# EAGLE design ASM2101 (EAGLE 6.3)
DATABASE: ./../../../../../Components/TinyCircuits_Part_Database.txt
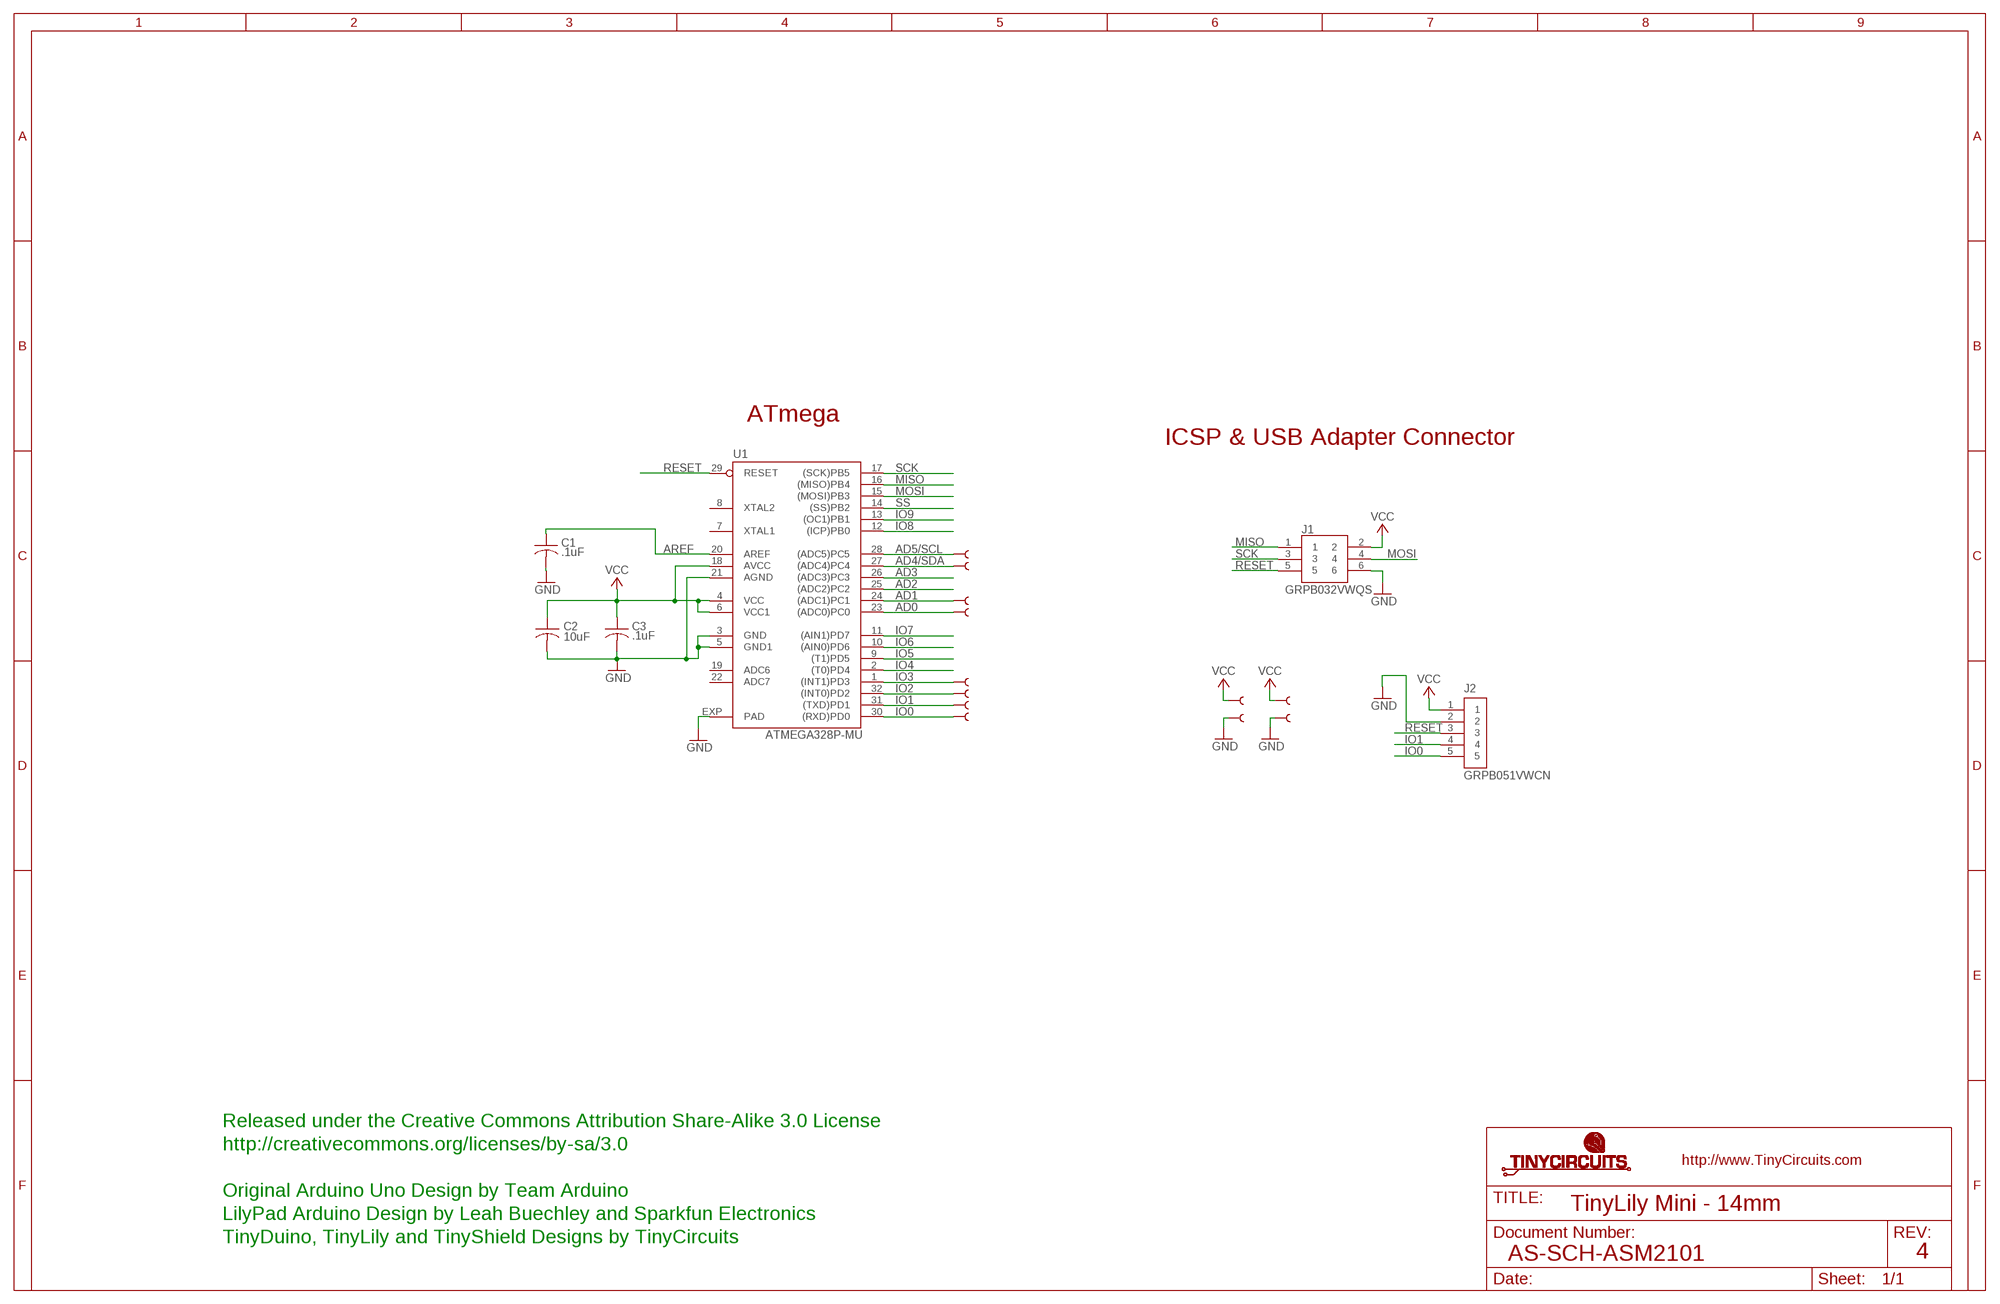
[diagram p0: schematic, sheet 1]

## Parts
$1  SEWTAB  [SEWTAP_TH]
C1  .1uF  AS-ITM-00008  [C0402]
C2  10uF  AS-ITM-00002  [C0603]
C3  .1uF  AS-ITM-00008  [C0402]
J1  GRPB032VWQS  AS-ITM-00034  [2X3_.05"_SMT_HEADER]
J2  GRPB051VWCN  AS-ITM-00036  [1X5_.05_RA_TH_HEADER]
U1  ATMEGA328P-MU  AS-ITM-00013MU  [ATMEL_QFN32]
U$1  SEWTAB  [SEWTAP_TH]
U$2  SEWTAB  [SEWTAP_TH]
U$3  SEWTAB  [SEWTAP_TH]
U$4  SEWTAB  [SEWTAP_TH]
U$5  SEWTAB  [SEWTAP_TH]
U$7  SEWTAB  [SEWTAP_TH]
U$8  SEWTAB  [SEWTAP_TH]
U$9  SEWTAB  [SEWTAP_TH]
U$10  SEWTAB  [SEWTAP_TH]
U$11  SEWTAB  [SEWTAP_TH]
U$12  SEWTAB  [SEWTAP_TH]

## Nets
AD0: U1.23((ADC0)PC0) U$4.1
AD1: U1.24((ADC1)PC1) U$3.1
AD2: U1.25((ADC2)PC2)
AD3: U1.26((ADC3)PC3)
AD4/SDA: U1.27((ADC4)PC4) U$2.1
AD5/SCL: U1.28((ADC5)PC5) U$1.1
AREF: C1.1 U1.20(AREF)
GND: C1.2 C2.2 C3.2 J1.6 J2.2 U1.3(GND) U1.5(GND1) U1.21(AGND) U1.EXP(PAD) U$11.1 U$12.1
IO0: J2.5 U1.30((RXD)PD0) U$10.1
IO1: J2.4 U1.31((TXD)PD1) U$9.1
IO2: $1.1 U1.32((INT0)PD2)
IO3: U1.1((INT1)PD3) U$5.1
IO4: U1.2((T0)PD4)
IO5: U1.9((T1)PD5)
IO6: U1.10((AIN0)PD6)
IO7: U1.11((AIN1)PD7)
IO8: U1.12((ICP)PB0)
IO9: U1.13((OC1)PB1)
MISO: J1.1 U1.16((MISO)PB4)
MOSI: J1.4 U1.15((MOSI)PB3)
RESET: J1.5 J2.3 U1.29(RESET)
SCK: J1.3 U1.17((SCK)PB5)
SS: U1.14((SS)PB2)
VCC: C2.1 C3.1 J1.2 J2.1 U1.4(VCC) U1.6(VCC1) U1.18(AVCC) U$7.1 U$8.1
Unconnected: U1.7(XTAL1) U1.8(XTAL2) U1.19(ADC6) U1.22(ADC7)

## Notes on the sheet
- ATmega
- ICSP & USB Adapter Connector
- Released under the Creative Commons Attribution Share-Alike 3.0 License
- http://creativecommons.org/licenses/by-sa/3.0
- Original Arduino Uno Design by Team Arduino
- TinyLily Mini - 14mm
- LilyPad Arduino Design by Leah Buechley and Sparkfun Electronics
- TinyDuino, TinyLily and TinyShield Designs by TinyCircuits
- AS-SCH-ASM2101 | 4

## Library data of the parts
$1 U$1-U$5 U$7-U$12 = tinycircuits:SEWTAB: TinyLily Sew Tab; BOM: EXCLUDE; DNP: T
C1 C3 = tinycircuits:AS-ITM-00008: CAP CER 0.1UF 16V 10% X5R 0402; PARTNO: AS-ITM-00008; VALUE: 0.1uF
C2 = tinycircuits:AS-ITM-00002: CAP CER 10UF 10V 20% X5R 0603; PARTNO: AS-ITM-00002
J1 = tinycircuits:AS-ITM-00034: CONN HEADER .050" SMD 6POS; DNP: T; PARTNO: AS-ITM-00034
J2 = tinycircuits:AS-ITM-00036: CONN HEADER .050" 5POS TH RA; PARTNO: AS-ITM-00036
U1 = tinycircuits:AS-ITM-00013: MCU AVR 32K FLASH 32-QFN; PARTNO: AS-ITM-00013

## Board
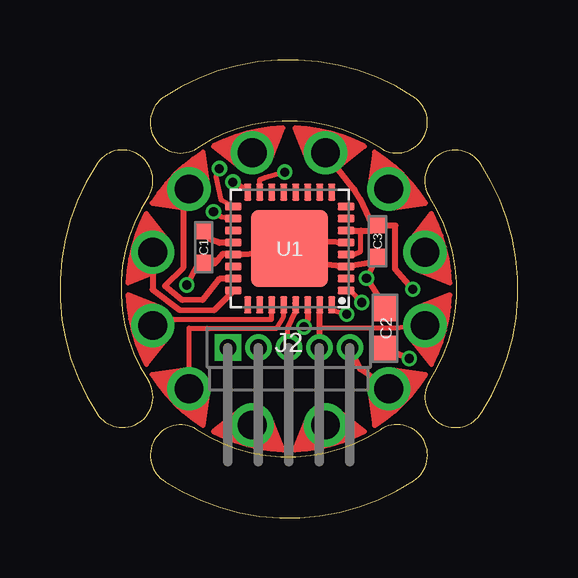
[diagram p1: board, top side]
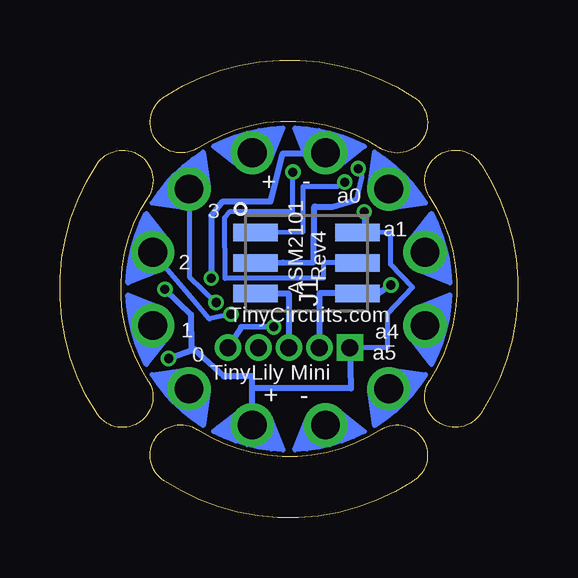
[diagram p2: board, bottom side, seen from below]

Size 19.07 x 19.07 mm. Coordinates in mm from the lower left corner, seen from the top.
Outline: 5.68,3.7 arc180 4.39,1.51 arc66 14.75,1.55 arc180 13.35,3.67 arc-66 5.68,3.7
Outline: 15.38,5.68 arc180 17.57,4.39 arc66 17.53,14.75 arc180 15.41,13.35 arc-66 15.38,5.68
Outline: 3.7,13.41 arc180 1.51,14.7 arc66 1.55,4.34 arc180 3.67,5.74 arc-66 3.7,13.41
Outline: 13.4,15.38 arc180 14.69,17.57 arc66 4.33,17.53 arc180 5.73,15.41 arc-66 13.4,15.38
Copper layers (1*16): Top 0.035mm / dielectric 1.5mm / Bottom 0.035mm
Design rules "default": minimum track width 8mil, minimum drill 15mil, track to track 6mil, track to pad 6mil, pad to pad 6mil, via to via 6mil, smd to smd 6mil, copper to edge 6mil, drill to drill 8mil, minimum pad ring 8mil, minimum via ring 5mil, stop-mask expansion 4mil, vias tented up to drill 25mil, thermal gap 10mil

### Footprints (pad centres in the part's own frame; a part is rotated, then mirrored left to right if it is on the bottom)
SEWTAP_TH = drill 1.2 pad 1.803: 1 -0.127,0
C0402 = smd 0.65 x 0.6: 1 -0.65,0; 2 0.65,0
C0603 = smd 1.1 x 1: 1 -0.85,0; 2 0.85,0
2X3_.05"_SMT_HEADER = smd 1.854 x 0.737: 1 -2.125,1.27; 2 2.125,1.27; 3 -2.125,0; 4 2.125,0; 5 -2.125,-1.27; 6 2.125,-1.27
1X5_.05_RA_TH_HEADER = drill 0.7 pad 1.016 square: 1 -0.635,2.54 | drill 0.7 pad 1.016: 2 -0.635,1.27; 3 -0.635,0; 4 -0.635,-1.27; 5 -0.635,-2.54
ATMEL_QFN32 = smd 0.711 x 0.305: 1 -2.351,1.75; 2 -2.351,1.25; 3 -2.351,0.75; 4 -2.351,0.25; 5 -2.351,-0.25; 6 -2.351,-0.75; 7 -2.351,-1.25; 8 -2.351,-1.75; 17 2.351,-1.75; 18 2.351,-1.25; 19 2.351,-0.75; 20 2.351,-0.25; 21 2.351,0.25; 22 2.351,0.75; 23 2.351,1.25; 24 2.351,1.75 | smd 0.305 x 0.711: 9 -1.75,-2.351; 10 -1.25,-2.351; 11 -0.75,-2.351; 12 -0.25,-2.351; 13 0.25,-2.351; 14 0.75,-2.351; 15 1.25,-2.351; 16 1.75,-2.351; 25 1.75,2.351; 26 1.25,2.351; 27 0.75,2.351; 28 0.25,2.351; 29 -0.25,2.351; 30 -0.75,2.351; 31 -1.25,2.351; 32 -1.75,2.351 | smd 3.2 x 3.2: EXP 0,0

### Placement (x,y rotation side)
$1  15.09,11.03 345 bottom
C1  5.99,11.27 270 top
C2  13.55,7.89 90 top
C3  13.23,11.53 270 top
J1  8.81,10.62 0 bottom
J2  9.54,7.72 90 top
U1  9.57,11.22 180 top
U$1  5.47,5.47 135 bottom
U$2  3.99,8.05 165 bottom
U$3  3.99,11.03 195 bottom
U$4  5.47,13.61 225 bottom
U$5  13.61,13.61 315 bottom
U$6  [DOCFIELD-TINYCIRCUITS-PCB]  32.54,-9.46 0 top  (outside the outline)
U$7  11.03,3.99 75 bottom
U$8  11.03,15.09 285 bottom
U$9  15.09,8.05 15 bottom
U$10  13.61,5.47 45 bottom
U$11  8.05,3.99 105 bottom
U$12  8.05,15.09 255 bottom

### Tracks (layer width: path | path; a pad name or v marks a point on that pad's centre or on a via)
AD0
  Top 0.203: 6.92,9.95 6.94,9.95
  Top 0.254: U$4.1 5.13,12.87 5.13,10.41 4.37,9.66 5.1,9.07 5.94,9.08 6.64,9.95 6.94,9.95 7.12,9.96 7.1,9.95 | 6.92,9.95 U1.23
AD1
  Top 0.254: U$3.1 3.86,9.51 4.97,8.66 6.44,8.65 7.23,9.47 U1.24
AD4/SDA
  Top 0.203: 8.81,8.84 8.81,8.26 4.11,8.26
  Top 0.254: U1.27 8.81,8.84 | 4.11,8.26 U$2.1
AD5/SCL
  Top 0.203: U$1.1 5.38,7.9 9.03,7.9 9.31,8.38 U1.28
AREF
  Top 0.254: U1.20 6.65,11.46 6.29,11.59 C1.1
GND  (via drill 0.38)
  Top 0.203: U1.EXP 8.89,11.07
  Top 0.254: U1.5 9.88,11.55 | 9.88,11.55 U1.EXP 10.69,10.58 U1.3 13.2,10.67 C3.2 v12.77,9.98 C2.2 | 8.89,11.07 U1.21 6.78,10.99 6.58,10.74 6.57,10.73 | 9.88,11.55 9.7,11.56 | C1.2 6.05,10.73 6.57,10.73 | 6.57,10.73 6.43,10.59 5.76,10.59 5.74,10.57 v5.28,9.7 | U$11.1 8.23,4.88 J2.2
  Bottom 0.254: v5.28,9.7 5.8,9.34 J1.6 8.27,9.35 J2.2 | U$12.1 8.06,15.17 9.8,15.17 10.31,13.18 12.29,13.18 12.77,12.57 v12.77,9.98
IO0  (via drill 0.38)
  Top 0.254: U1.30 10.32,8.27 v10.17,7.95 | U$10.1 12.49,6.2 J2.5
  Bottom 0.254: v10.17,7.95 11.53,7.94 J2.5
IO1
  Top 0.203: U$9.1 13.97,7.9 11.27,7.9 10.83,7.9
  Top 0.254: J2.4 10.83,7.9 U1.31
IO2  (via drill 0.38)
  Top 0.203: 11.3,8.66 v11.95,8.47
  Top 0.254: U1.32 11.3,8.66
  Bottom 0.203: v11.95,8.47 12.85,8.28 13.38,8.92 13.84,9.45 $1.1
IO3  (via drill 0.38)
  Top 0.203: v12.57,8.97 12.11,9.48
  Top 0.254: 12.11,9.48 U1.1
  Bottom 0.203: U$5.1 13.69,10.8 13.69,10.03 v12.57,8.97
MISO  (via drill 0.38)
  Top 0.203: v7.2,13.99 7.82,13.69
  Top 0.254: 7.82,13.69 U1.16
  Bottom 0.203: 11.17,11.89 8.94,11.91 8.94,13.81 7.51,13.81 v7.2,13.99
  Bottom 0.254: J1.1 11.17,11.89
MOSI  (via drill 0.38)
  Top 0.203: v9.37,14.4 8.56,14.17 8.3,14.07 U1.15
  Bottom 0.203: J1.4 8.1,10.62 8.1,9.99 12.19,9.97 12.22,12.5 12,12.76 9.38,12.76 v9.37,14.4
RESET
  Top 0.203: 9.5,7.31 9.49,7.91 9.8,8.56 U1.29
  Top 0.254: U1.29 9.8,8.98 9.8,8.68 | J2.3 9.5,7.31
  Bottom 0.254: J1.5 9.55,9.35 J2.3
SCK  (via drill 0.38)
  Top 0.203: U1.17 6.72,13.25 6.5,14.21 v6.64,14.55
  Bottom 0.203: v6.64,14.55 6.5,14.23 6.73,13.26
  Bottom 0.254: J1.3 10.69,10.61 9.79,10.63 8.5,10.65 8.47,12.96 8.42,12.96 7.72,12.96 6.73,13.26
VCC  (via drill 0.38)
  Top 0.203: U1.4 12.22,10.96 12.53,11.1 12.54,11.97 | v6.4,12.75 6.35,12.63 6.55,12.62 6.74,12.54 U1.18
  Top 0.254: U$8.1 11.99,13.99 12.27,13.67 12.5,13.27 13.02,12.18 13.03,11.97 U1.6 12.54,11.97 12.99,11.95 C3.1 13.98,12.17 13.97,10.36 v14.7,9.53 | 10.92,4.09 11.03,3.99 U$7.1 | C2.1 v14.55,6.64
  Bottom 0.203: J2.1 5.44,7.09 5.44,8.51 4.39,9.6 5.31,10.56 5.3,11.91 J1.2 6.35,11.96 v6.4,12.75
  Bottom 0.254: v14.55,6.64 13.48,7.03 | 13.48,7.03 13.59,7.09 13.61,8.46 v14.7,9.53 | 11.03,3.99 U$7.1 11.07,5.39 | 11.07,5.39 11.07,5.89 12.24,5.89 13.48,7.03 | J2.1 6.96,5.39 11.07,5.39

### Text on the board
bPlace: a0 | - | + | 3 | a1 | 2 | Rev4 | ASM2101 | TinyCircuits.com | a4 | 1 | a5 | 0 | TinyLily Mini | - | +
Document: FABRICATION DRAWING | NOTES: | 1. PRINTED CIRCUIT BOARD MADE FROM NEMA GRADE FR-4 EPOXY LAMINATE | WITH 1 OUNCE COPPER PLATING AND .024 THICKNESS. | 2. ALL DIMENSIONS ARE GIVEN IN INCHES. | 3. CIRCUIT PATHS ARE FOR REFERENCE ONLY. | 4. HOLE SIZES SHOWN ARE FINISHED DIAMETERS AFTER PLATING. | 5. BOARD PLATED USING REFLOW OR SIMILAR METHOD. | 6. BOARD TO HAVE BLUE SOLDER MASK ON PLATED SURFACES USING WET FILM | 7. SILKSCREEN BOARD USING WHITE INK. | SR100 OR SR1010 EPOXY. EQUIVALENT WET OR DRY FILM MAY BE USED. | 8. THE FOLLOWING INFORMATION APPLIES TO THIS BOARD: | * 2 COPPER LAYERS | * .024 BOARD THICKNESS | * REQUIRES TOP SIDE SILKSCREEN | Released under the Creative Commons Attribution Share-Alike 3.0 License | http://creativecommons.org/licenses/by-sa/3.0 | LilyPad Arduino Design by Leah Buechley and Sparkfun Electronics | Original Arduino Uno Design by Team Arduino | TinyDuino, TinyLily and TinyShield Designs by TinyCircuits | TinyLily Mini - 14mm | AS-PCB-ASM2101 | 4